# Altium schematic sheet Top.SchDoc: fNIRS - Top
size A4; CompanyName: UofT Capstone Team 2024991; DrawnBy: Tony Kim; Revision: 1; SheetNumber: 1; SheetTotal: 13
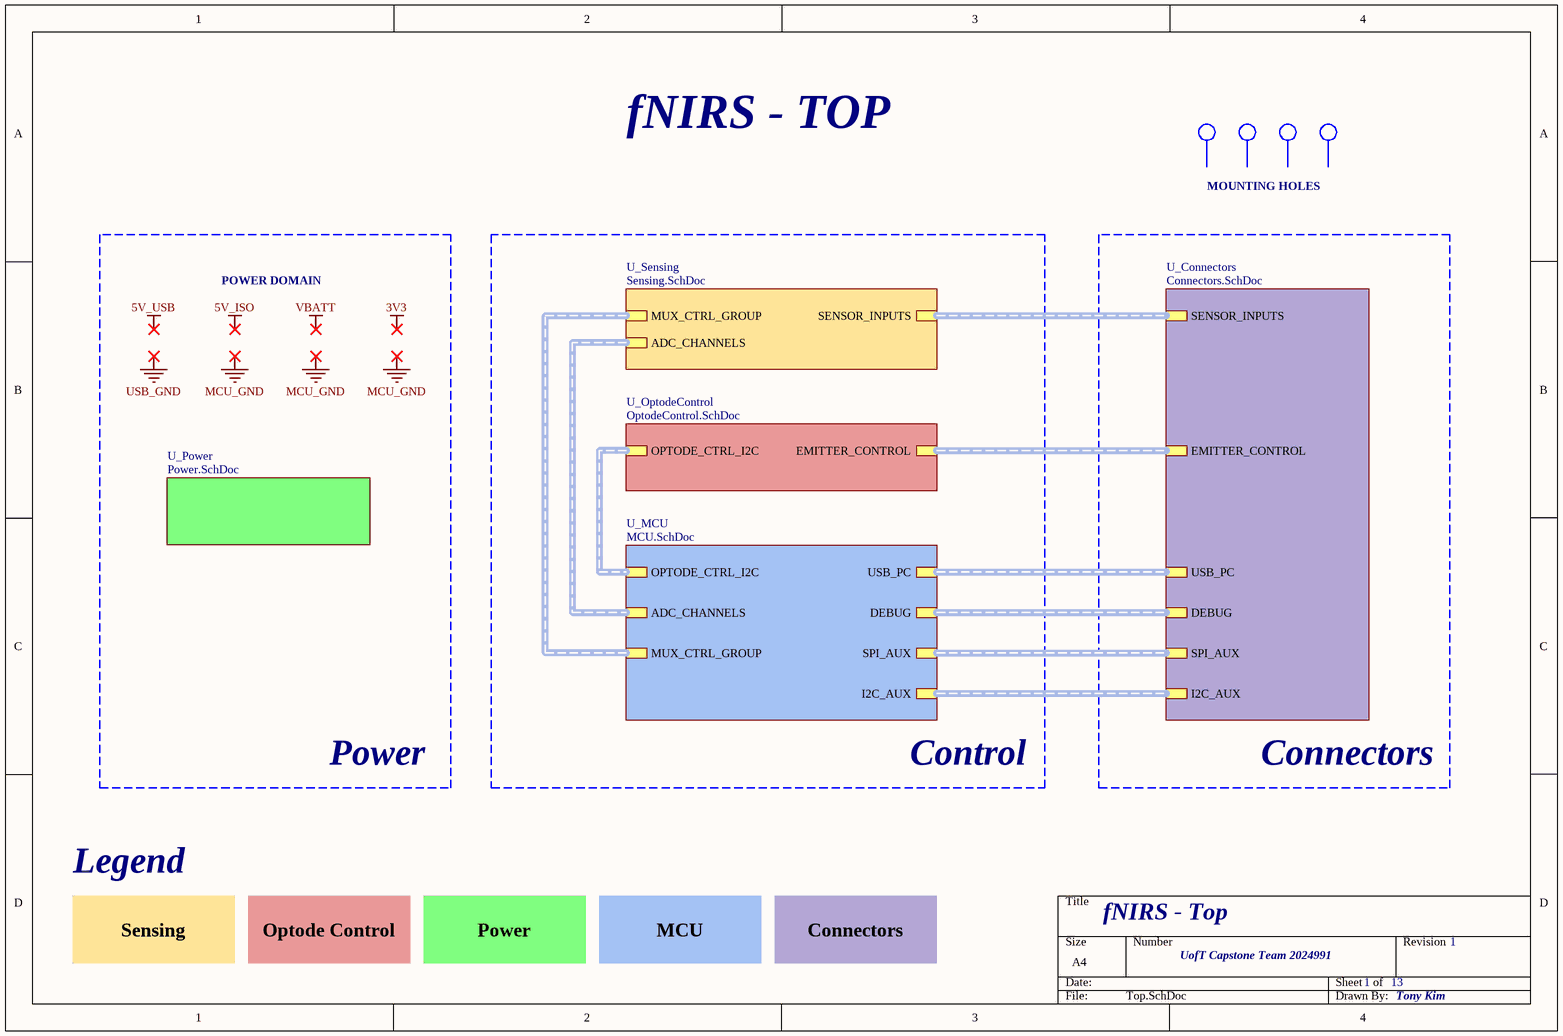
[diagram p0: Top.SchDoc]

## Parts
MH1  M3 Mounting Hole  [New footprint 1]  (value not drawn)
MH2  M3 Mounting Hole  [New footprint 1]  (value not drawn)
MH3  M3 Mounting Hole  [New footprint 1]  (value not drawn)
MH4  M3 Mounting Hole  [New footprint 1]  (value not drawn)

## Sub-sheets
U_Connectors = Connectors.SchDoc: USB_PC (harness USB_PC), EMITTER_CONTROL (harness EMITTER_CONTROL), SENSOR_INPUTS (harness SENSOR_INPUTS), DEBUG (harness DEBUG), SPI_AUX (harness SPI_AUX), I2C_AUX (harness SPI_AUX)
U_MCU = MCU.SchDoc: ADC_CHANNELS (harness ADC_CHANNELS), DEBUG (harness DEBUG), OPTODE_CTRL_I2C (harness OPTODE_CTRL_I2C), MUX_CTRL_GROUP (harness MUX_SEL_GPIOS), SPI_AUX (harness SPI_AUX), USB_PC (harness USB_PC), I2C_AUX (harness SPI_AUX)
U_OptodeControl = OptodeControl.SchDoc: EMITTER_CONTROL (harness EMITTER_CONTROL), OPTODE_CTRL_I2C (harness OPTODE_CTRL_I2C)
U_Power = Power.SchDoc: no entries
U_Sensing = Sensing.SchDoc: SENSOR_INPUTS (harness SENSOR_INPUTS), MUX_CTRL_GROUP (harness MUX_CTRL_GROUP), ADC_CHANNELS (harness ADC_CHANNELS)

## Buses and harness runs
harness sheet U_Connectors/DEBUG = sheet U_MCU/DEBUG
harness sheet U_Connectors/EMITTER_CONTROL = sheet U_OptodeControl/EMITTER_CONTROL
harness sheet U_Connectors/I2C_AUX = sheet U_MCU/I2C_AUX
harness sheet U_Connectors/SENSOR_INPUTS = sheet U_Sensing/SENSOR_INPUTS
harness sheet U_Connectors/SPI_AUX = sheet U_MCU/SPI_AUX
harness sheet U_Connectors/USB_PC = sheet U_MCU/USB_PC
harness sheet U_MCU/ADC_CHANNELS = sheet U_Sensing/ADC_CHANNELS
harness sheet U_MCU/MUX_CTRL_GROUP = sheet U_Sensing/MUX_CTRL_GROUP
harness sheet U_MCU/OPTODE_CTRL_I2C = sheet U_OptodeControl/OPTODE_CTRL_I2C

## Notes on the sheet
- fNIRS - TOP
- MOUNTING HOLES
- POWER DOMAIN
- Power
- Control
- Connectors
- Legend
- Sensing
- Optode Control
- MCU
- Labels drawn without touching a wire or pin: 3V3, 5V_ISO, 5V_USB, MCU_GND, USB_GND, VBATT

## Library data of the parts
MH1-MH4 = CMP-004-0008-2